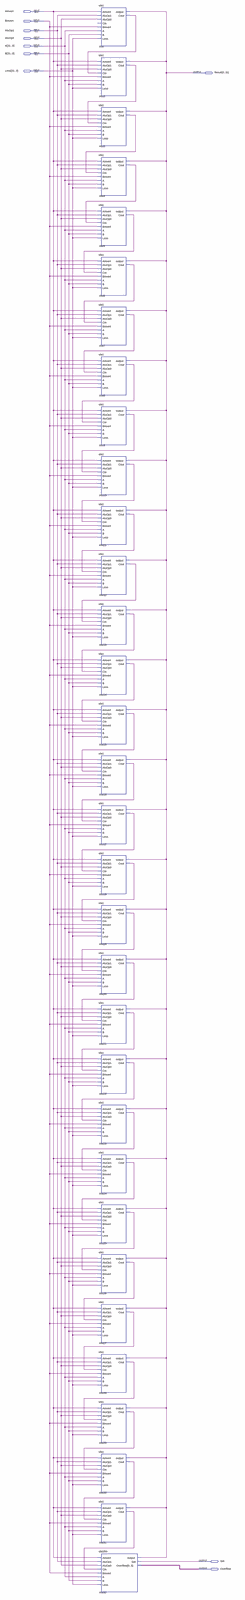
[diagram p0: schematic sheet, whole]
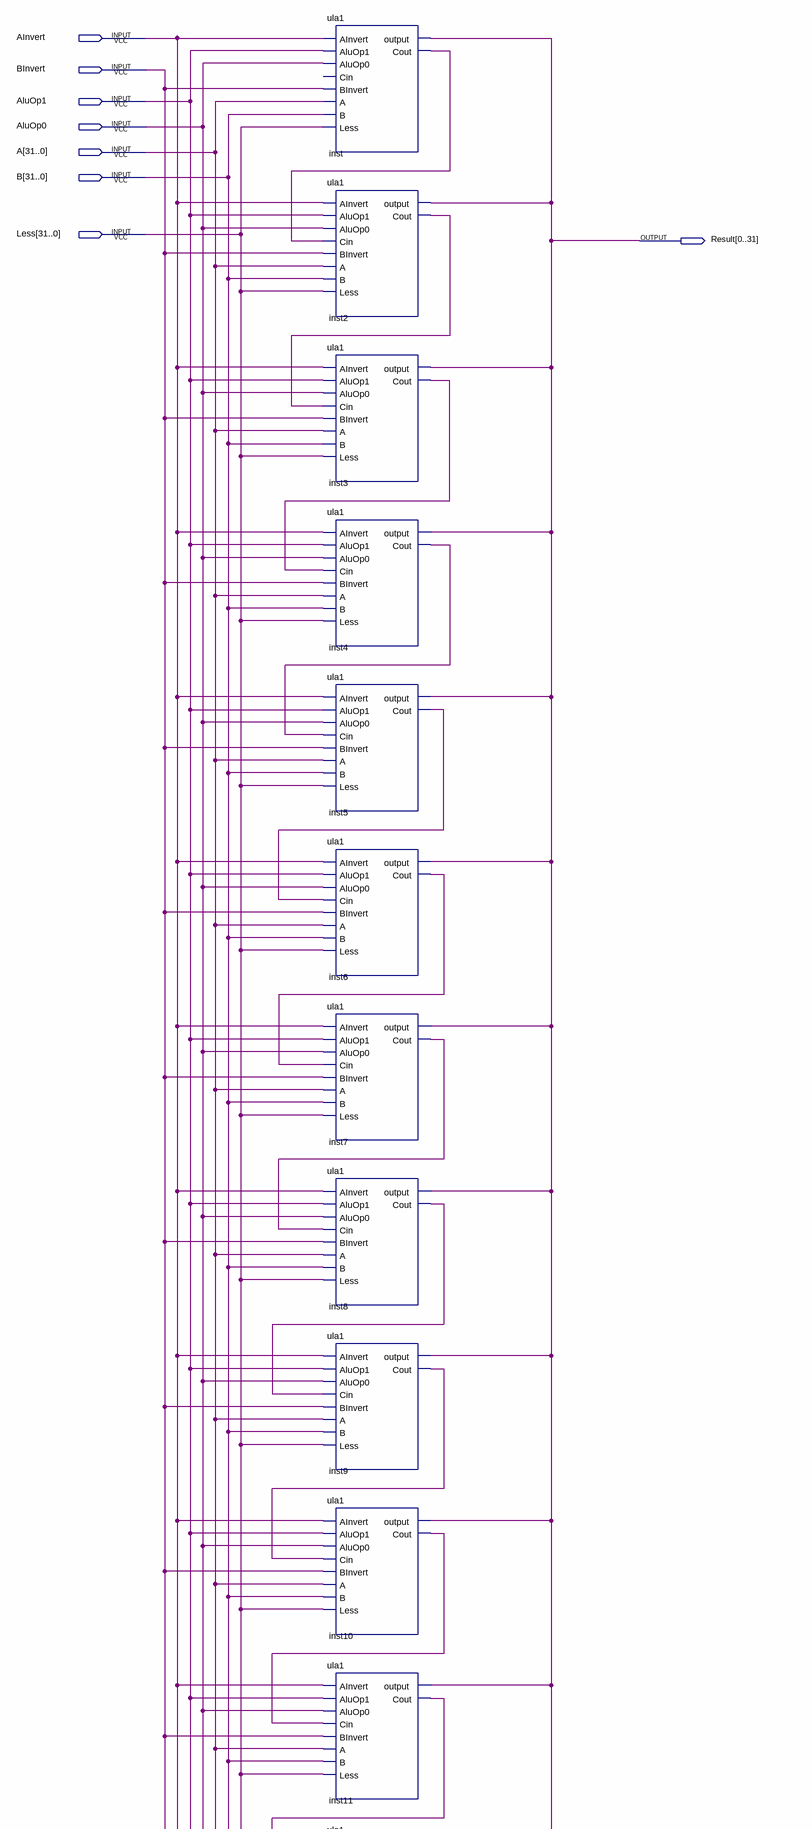
[diagram p1: schematic sheet, upper part]
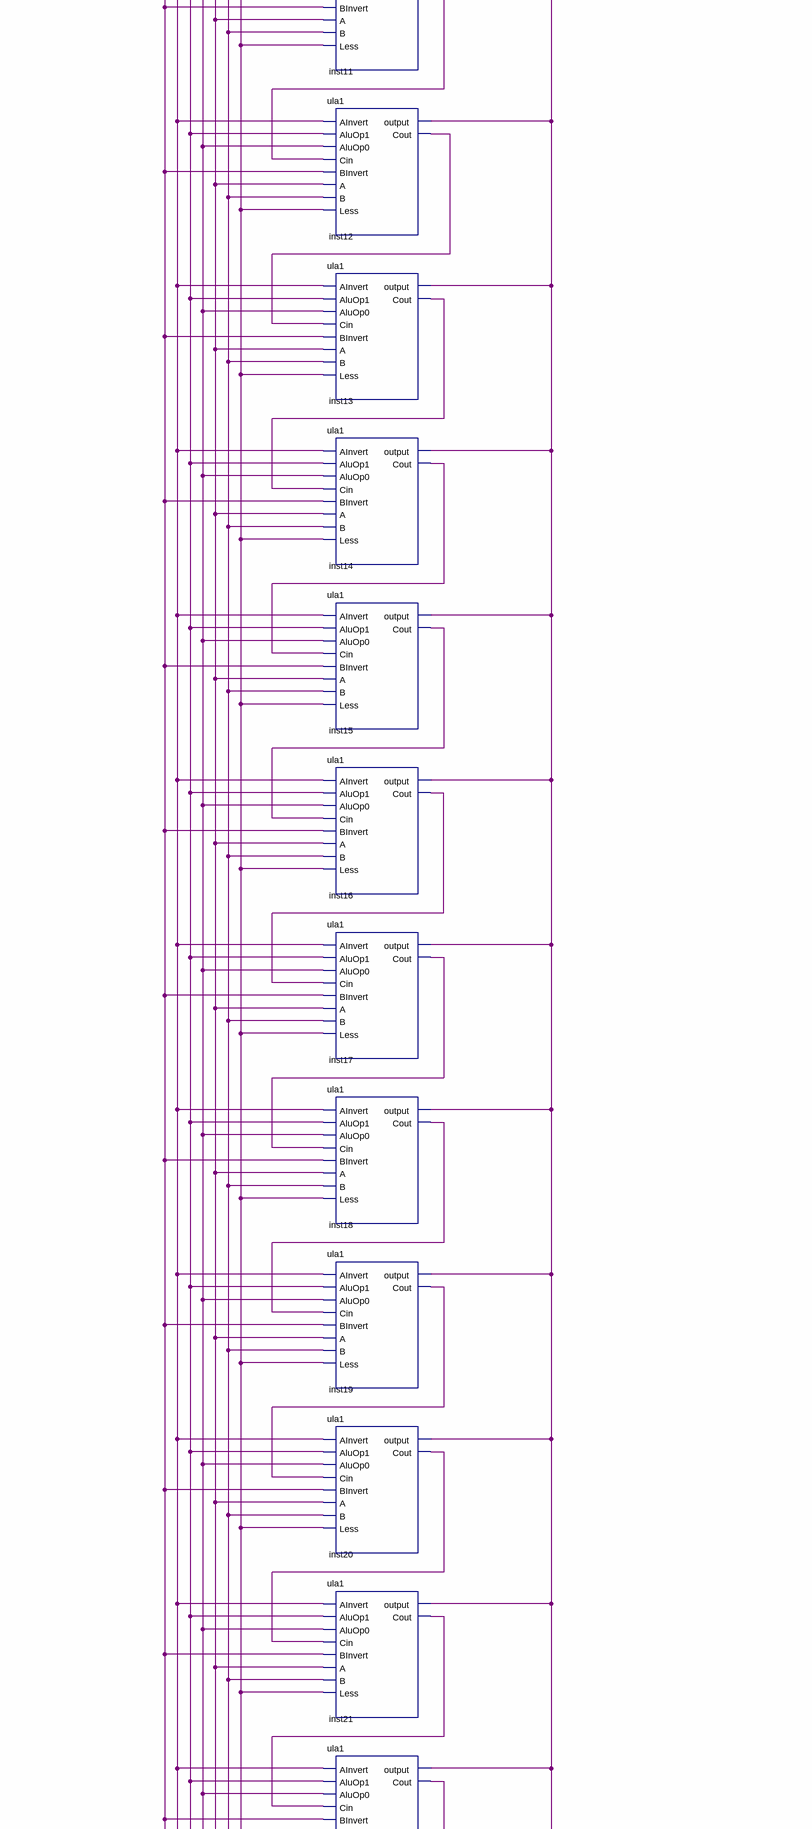
[diagram p2: schematic sheet, middle part]
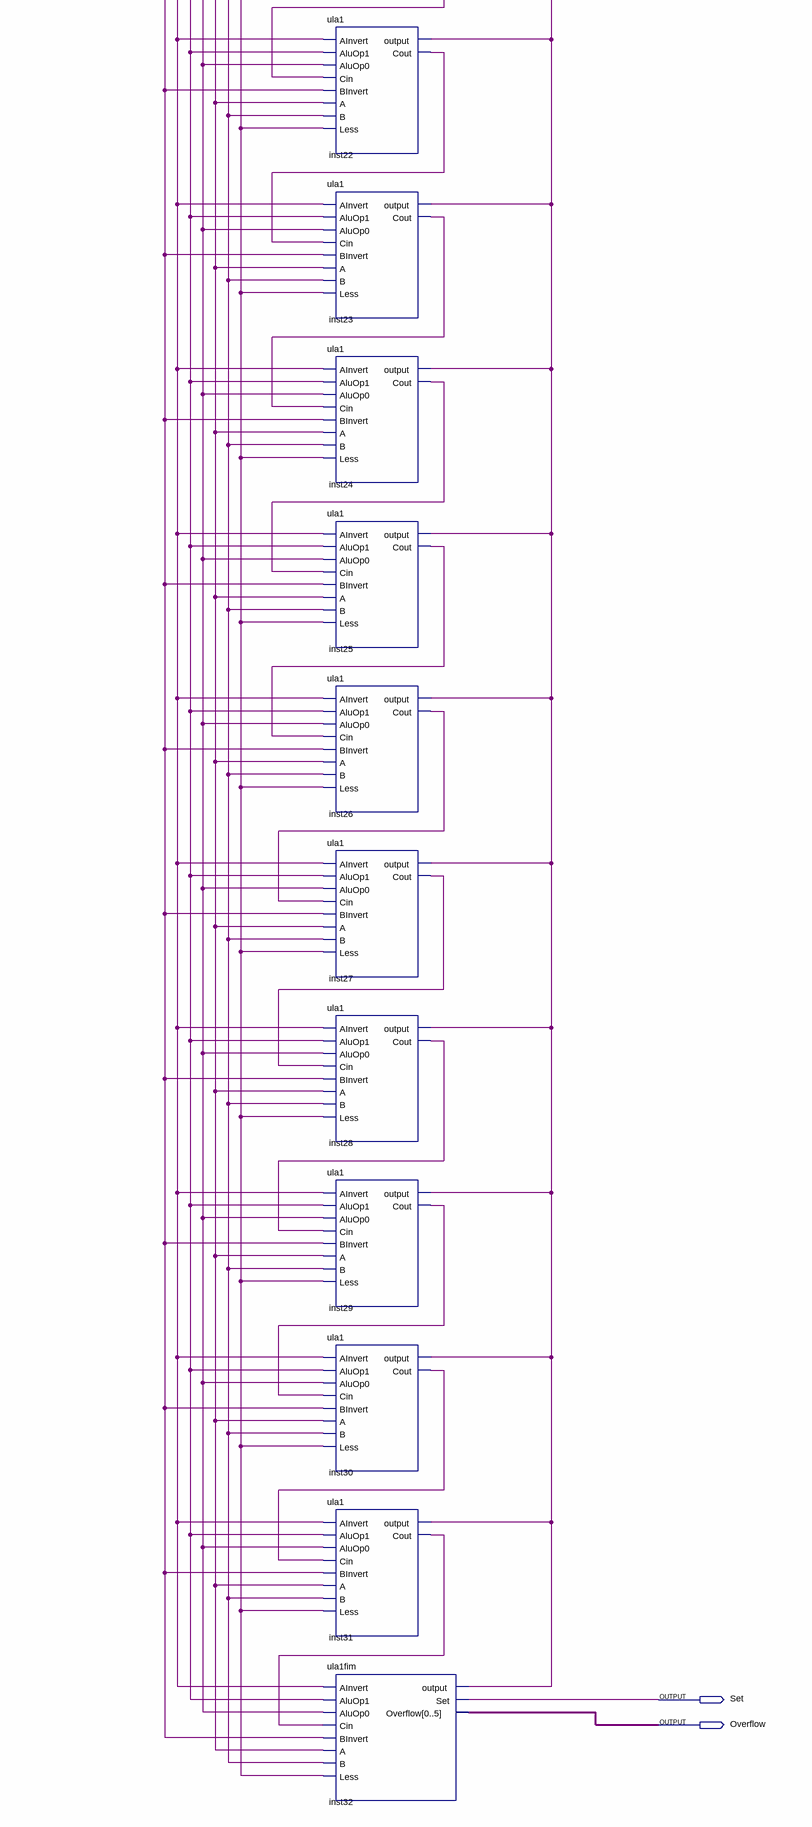
[diagram p3: schematic sheet, lower part]
// Quartus schematic ula32.bdf as structural Verilog: 32 symbols, 10 pins
module ula32 (
  input  AInvert,
  input  BInvert,
  input  AluOp1,
  input  AluOp0,
  input  [31:0] A,
  input  [31:0] B,
  input  [31:0] Less,
  output [0:31] Result,
  output Set,
  output Overflow
);

  wire inst2_cout, inst3_cout, inst4_cout, inst5_cout, inst6_cout, inst7_cout, inst8_cout, inst9_cout,
       inst10_cout, inst11_cout, inst12_cout, inst13_cout, inst14_cout, inst15_cout, inst16_cout,
       inst17_cout, inst18_cout, inst19_cout, inst20_cout, inst21_cout, inst22_cout, inst23_cout,
       inst24_cout, inst25_cout, inst26_cout, inst27_cout, inst28_cout, inst29_cout, inst30_cout,
       inst31_cout, inst_cout, inst_output, undriven, undriven_2, undriven_3;
  wire [5:0] inst32_overflow;

  ula1 inst (
    .AInvert(AInvert), .AluOp1(AluOp1), .AluOp0(AluOp0), .BInvert(BInvert), .A(undriven), .B(undriven_2),
    .Less(undriven_3), .\output (inst_output), .Cout(inst_cout));  // open: Cin
  ula1 inst2 (
    .AInvert(AInvert), .AluOp1(AluOp1), .AluOp0(AluOp0), .Cin(inst_cout), .BInvert(BInvert), .A(undriven),
    .B(undriven_2), .Less(undriven_3), .\output (inst_output), .Cout(inst2_cout));
  ula1 inst3 (
    .AInvert(AInvert), .AluOp1(AluOp1), .AluOp0(AluOp0), .Cin(inst2_cout), .BInvert(BInvert), .A(undriven),
    .B(undriven_2), .Less(undriven_3), .\output (inst_output), .Cout(inst3_cout));
  ula1 inst4 (
    .AInvert(AInvert), .AluOp1(AluOp1), .AluOp0(AluOp0), .Cin(inst3_cout), .BInvert(BInvert), .A(undriven),
    .B(undriven_2), .Less(undriven_3), .\output (inst_output), .Cout(inst4_cout));
  ula1 inst5 (
    .AInvert(AInvert), .AluOp1(AluOp1), .AluOp0(AluOp0), .Cin(inst4_cout), .BInvert(BInvert), .A(undriven),
    .B(undriven_2), .Less(undriven_3), .\output (inst_output), .Cout(inst5_cout));
  ula1 inst6 (
    .AInvert(AInvert), .AluOp1(AluOp1), .AluOp0(AluOp0), .Cin(inst5_cout), .BInvert(BInvert), .A(undriven),
    .B(undriven_2), .Less(undriven_3), .\output (inst_output), .Cout(inst6_cout));
  ula1 inst7 (
    .AInvert(AInvert), .AluOp1(AluOp1), .AluOp0(AluOp0), .Cin(inst6_cout), .BInvert(BInvert), .A(undriven),
    .B(undriven_2), .Less(undriven_3), .\output (inst_output), .Cout(inst7_cout));
  ula1 inst8 (
    .AInvert(AInvert), .AluOp1(AluOp1), .AluOp0(AluOp0), .Cin(inst7_cout), .BInvert(BInvert), .A(undriven),
    .B(undriven_2), .Less(undriven_3), .\output (inst_output), .Cout(inst8_cout));
  ula1 inst9 (
    .AInvert(AInvert), .AluOp1(AluOp1), .AluOp0(AluOp0), .Cin(inst8_cout), .BInvert(BInvert), .A(undriven),
    .B(undriven_2), .Less(undriven_3), .\output (inst_output), .Cout(inst9_cout));
  ula1 inst10 (
    .AInvert(AInvert), .AluOp1(AluOp1), .AluOp0(AluOp0), .Cin(inst9_cout), .BInvert(BInvert), .A(undriven),
    .B(undriven_2), .Less(undriven_3), .\output (inst_output), .Cout(inst10_cout));
  ula1 inst11 (
    .AInvert(AInvert), .AluOp1(AluOp1), .AluOp0(AluOp0), .Cin(inst10_cout), .BInvert(BInvert), .A(undriven),
    .B(undriven_2), .Less(undriven_3), .\output (inst_output), .Cout(inst11_cout));
  ula1 inst12 (
    .AInvert(AInvert), .AluOp1(AluOp1), .AluOp0(AluOp0), .Cin(inst11_cout), .BInvert(BInvert), .A(undriven),
    .B(undriven_2), .Less(undriven_3), .\output (inst_output), .Cout(inst12_cout));
  ula1 inst13 (
    .AInvert(AInvert), .AluOp1(AluOp1), .AluOp0(AluOp0), .Cin(inst12_cout), .BInvert(BInvert), .A(undriven),
    .B(undriven_2), .Less(undriven_3), .\output (inst_output), .Cout(inst13_cout));
  ula1 inst14 (
    .AInvert(AInvert), .AluOp1(AluOp1), .AluOp0(AluOp0), .Cin(inst13_cout), .BInvert(BInvert), .A(undriven),
    .B(undriven_2), .Less(undriven_3), .\output (inst_output), .Cout(inst14_cout));
  ula1 inst15 (
    .AInvert(AInvert), .AluOp1(AluOp1), .AluOp0(AluOp0), .Cin(inst14_cout), .BInvert(BInvert), .A(undriven),
    .B(undriven_2), .Less(undriven_3), .\output (inst_output), .Cout(inst15_cout));
  ula1 inst16 (
    .AInvert(AInvert), .AluOp1(AluOp1), .AluOp0(AluOp0), .Cin(inst15_cout), .BInvert(BInvert), .A(undriven),
    .B(undriven_2), .Less(undriven_3), .\output (inst_output), .Cout(inst16_cout));
  ula1 inst17 (
    .AInvert(AInvert), .AluOp1(AluOp1), .AluOp0(AluOp0), .Cin(inst16_cout), .BInvert(BInvert), .A(undriven),
    .B(undriven_2), .Less(undriven_3), .\output (inst_output), .Cout(inst17_cout));
  ula1 inst18 (
    .AInvert(AInvert), .AluOp1(AluOp1), .AluOp0(AluOp0), .Cin(inst17_cout), .BInvert(BInvert), .A(undriven),
    .B(undriven_2), .Less(undriven_3), .\output (inst_output), .Cout(inst18_cout));
  ula1 inst19 (
    .AInvert(AInvert), .AluOp1(AluOp1), .AluOp0(AluOp0), .Cin(inst18_cout), .BInvert(BInvert), .A(undriven),
    .B(undriven_2), .Less(undriven_3), .\output (inst_output), .Cout(inst19_cout));
  ula1 inst20 (
    .AInvert(AInvert), .AluOp1(AluOp1), .AluOp0(AluOp0), .Cin(inst19_cout), .BInvert(BInvert), .A(undriven),
    .B(undriven_2), .Less(undriven_3), .\output (inst_output), .Cout(inst20_cout));
  ula1 inst21 (
    .AInvert(AInvert), .AluOp1(AluOp1), .AluOp0(AluOp0), .Cin(inst20_cout), .BInvert(BInvert), .A(undriven),
    .B(undriven_2), .Less(undriven_3), .\output (inst_output), .Cout(inst21_cout));
  ula1 inst22 (
    .AInvert(AInvert), .AluOp1(AluOp1), .AluOp0(AluOp0), .Cin(inst21_cout), .BInvert(BInvert), .A(undriven),
    .B(undriven_2), .Less(undriven_3), .\output (inst_output), .Cout(inst22_cout));
  ula1 inst23 (
    .AInvert(AInvert), .AluOp1(AluOp1), .AluOp0(AluOp0), .Cin(inst22_cout), .BInvert(BInvert), .A(undriven),
    .B(undriven_2), .Less(undriven_3), .\output (inst_output), .Cout(inst23_cout));
  ula1 inst24 (
    .AInvert(AInvert), .AluOp1(AluOp1), .AluOp0(AluOp0), .Cin(inst23_cout), .BInvert(BInvert), .A(undriven),
    .B(undriven_2), .Less(undriven_3), .\output (inst_output), .Cout(inst24_cout));
  ula1 inst25 (
    .AInvert(AInvert), .AluOp1(AluOp1), .AluOp0(AluOp0), .Cin(inst24_cout), .BInvert(BInvert), .A(undriven),
    .B(undriven_2), .Less(undriven_3), .\output (inst_output), .Cout(inst25_cout));
  ula1 inst26 (
    .AInvert(AInvert), .AluOp1(AluOp1), .AluOp0(AluOp0), .Cin(inst25_cout), .BInvert(BInvert), .A(undriven),
    .B(undriven_2), .Less(undriven_3), .\output (inst_output), .Cout(inst26_cout));
  ula1 inst27 (
    .AInvert(AInvert), .AluOp1(AluOp1), .AluOp0(AluOp0), .Cin(inst26_cout), .BInvert(BInvert), .A(undriven),
    .B(undriven_2), .Less(undriven_3), .\output (inst_output), .Cout(inst27_cout));
  ula1 inst28 (
    .AInvert(AInvert), .AluOp1(AluOp1), .AluOp0(AluOp0), .Cin(inst27_cout), .BInvert(BInvert), .A(undriven),
    .B(undriven_2), .Less(undriven_3), .\output (inst_output), .Cout(inst28_cout));
  ula1 inst29 (
    .AInvert(AInvert), .AluOp1(AluOp1), .AluOp0(AluOp0), .Cin(inst28_cout), .BInvert(BInvert), .A(undriven),
    .B(undriven_2), .Less(undriven_3), .\output (inst_output), .Cout(inst29_cout));
  ula1 inst30 (
    .AInvert(AInvert), .AluOp1(AluOp1), .AluOp0(AluOp0), .Cin(inst29_cout), .BInvert(BInvert), .A(undriven),
    .B(undriven_2), .Less(undriven_3), .\output (inst_output), .Cout(inst30_cout));
  ula1 inst31 (
    .AInvert(AInvert), .AluOp1(AluOp1), .AluOp0(AluOp0), .Cin(inst30_cout), .BInvert(BInvert), .A(undriven),
    .B(undriven_2), .Less(undriven_3), .\output (inst_output), .Cout(inst31_cout));
  ula1fim inst32 (
    .AInvert(AInvert), .AluOp1(AluOp1), .AluOp0(AluOp0), .Cin(inst31_cout), .BInvert(BInvert), .A(undriven),
    .B(undriven_2), .Less(undriven_3), .\output (inst_output), .Set(Set), .Overflow(inst32_overflow));
endmodule
